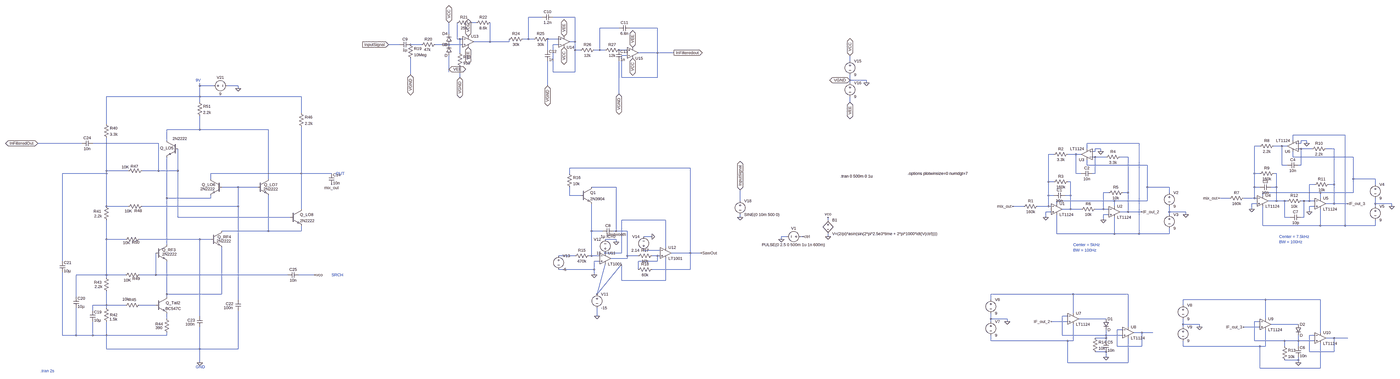
[diagram p0: schematic FullIntegration.asc, whole sheet]
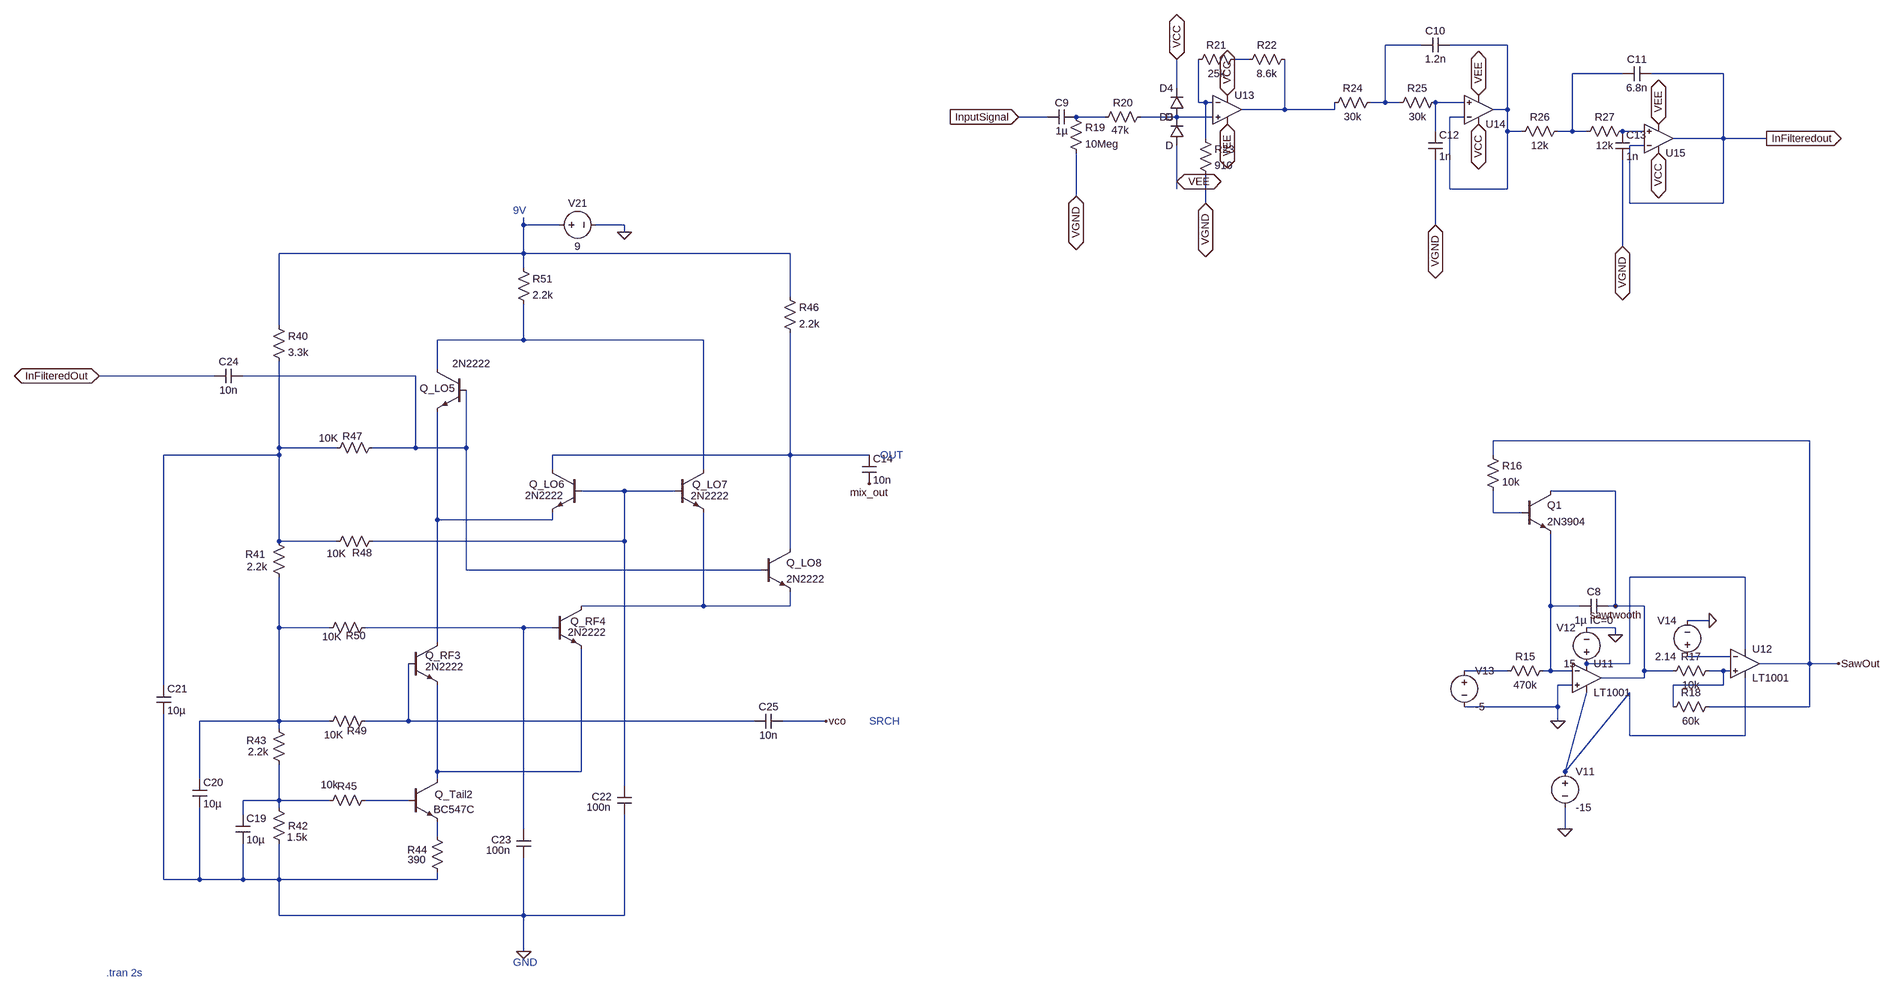
[diagram p1: schematic FullIntegration.asc, part, row 1 of 1, column 1 of 2]
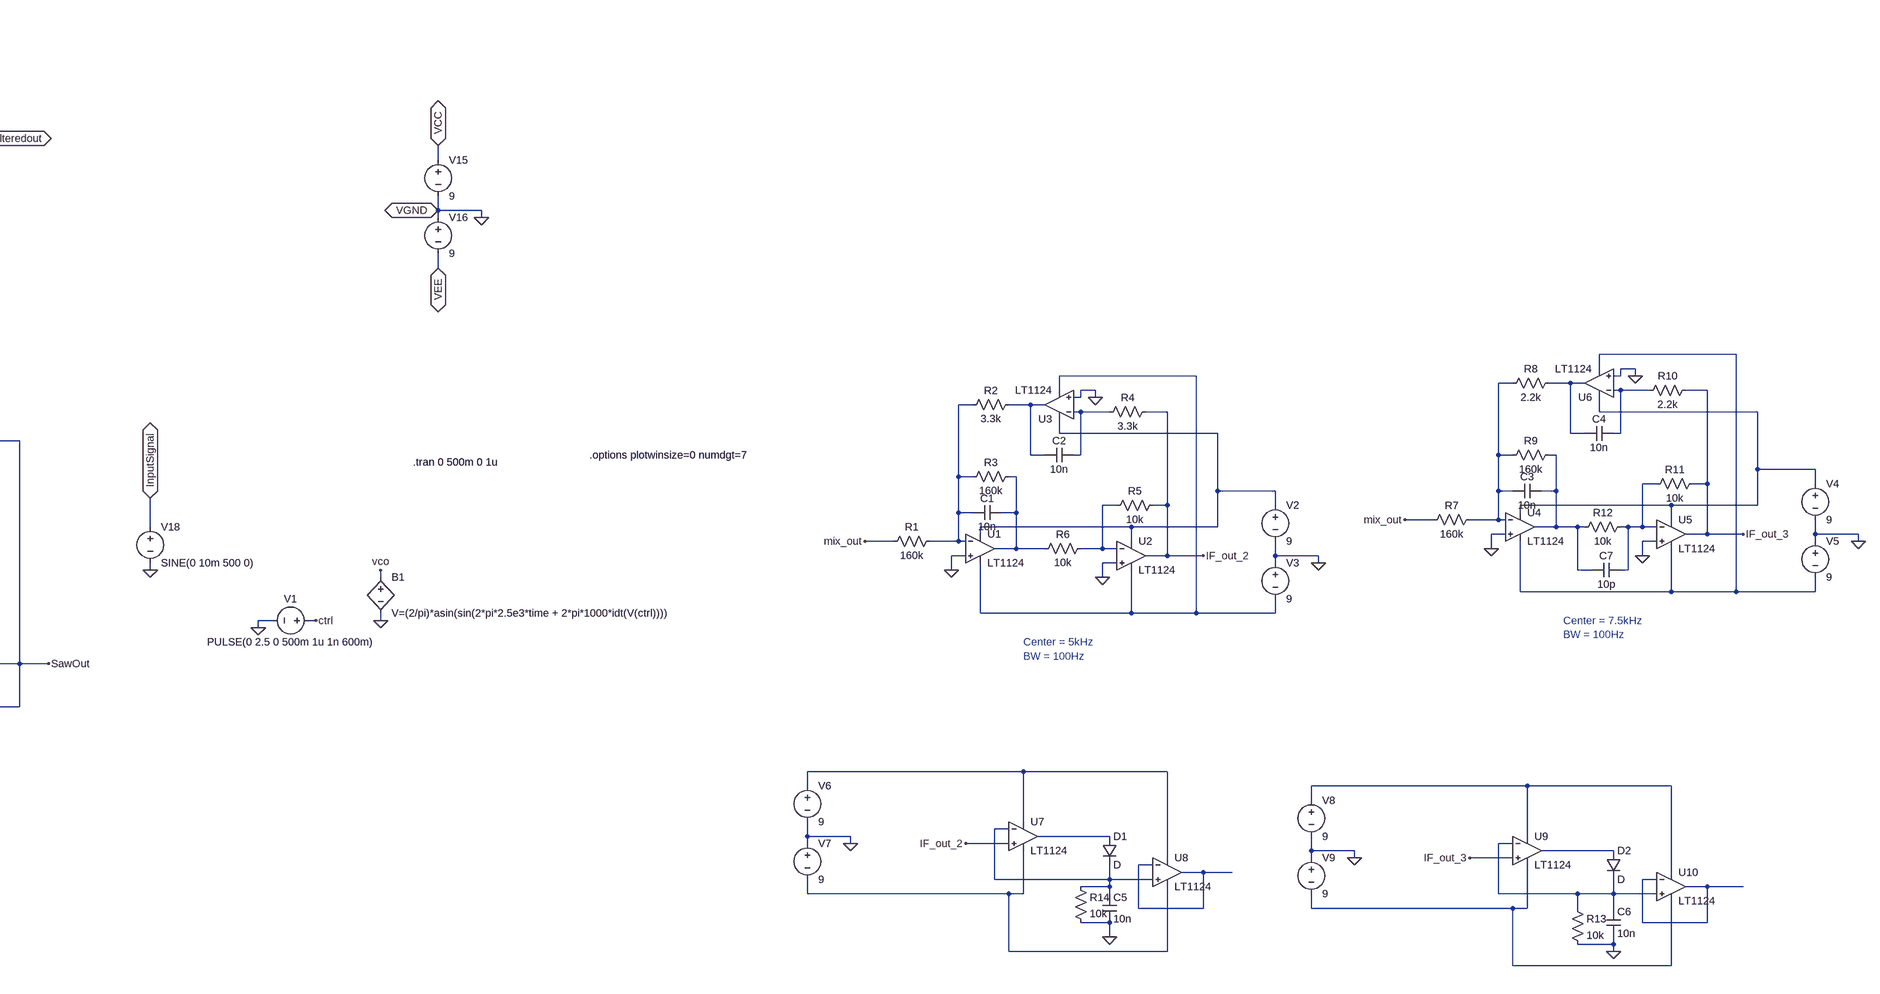
[diagram p2: schematic FullIntegration.asc, part, row 1 of 1, column 2 of 2]
FullIntegration.asc, the LTspice schematic file:
Version 4.1
SHEET 1 3748 744
WIRE -1664 -2064 -1744 -2064
WIRE -1472 -2064 -1600 -2064
WIRE -2400 -2032 -2432 -2032
WIRE -1216 -2000 -1328 -2000
WIRE -992 -2000 -1152 -2000
WIRE -2560 -1968 -2560 -2032
WIRE -2512 -1936 -2512 -2032
WIRE -2496 -1936 -2512 -1936
WIRE -2480 -1936 -2496 -1936
WIRE -1744 -1936 -1744 -2064
WIRE -1744 -1936 -1776 -1936
WIRE -1712 -1936 -1744 -1936
WIRE -1568 -1936 -1632 -1936
WIRE -2320 -1920 -2320 -2032
WIRE -2320 -1920 -2416 -1920
WIRE -1856 -1920 -1856 -1936
WIRE -1856 -1920 -2320 -1920
WIRE -1472 -1920 -1472 -2064
WIRE -1472 -1920 -1504 -1920
WIRE -2848 -1904 -2912 -1904
WIRE -2720 -1904 -2784 -1904
WIRE -2560 -1904 -2640 -1904
WIRE -2480 -1904 -2560 -1904
WIRE -1568 -1904 -1600 -1904
WIRE -1632 -1872 -1632 -1936
WIRE -1472 -1872 -1472 -1920
WIRE -1440 -1872 -1472 -1872
WIRE -1328 -1872 -1328 -2000
WIRE -1328 -1872 -1360 -1872
WIRE -1296 -1872 -1328 -1872
WIRE -1168 -1872 -1216 -1872
WIRE -2496 -1856 -2496 -1936
WIRE -992 -1856 -992 -2000
WIRE -992 -1856 -1104 -1856
WIRE -896 -1856 -992 -1856
WIRE -1168 -1840 -1200 -1840
WIRE 240 -1808 240 -1840
WIRE -2560 -1760 -2560 -1840
WIRE -2560 -1744 -2560 -1760
WIRE -1600 -1744 -1600 -1904
WIRE -1472 -1744 -1472 -1872
WIRE -1472 -1744 -1600 -1744
WIRE -2784 -1728 -2784 -1824
WIRE -2496 -1712 -2496 -1776
WIRE -1200 -1712 -1200 -1840
WIRE -992 -1712 -992 -1856
WIRE -992 -1712 -1200 -1712
WIRE 240 -1696 240 -1728
WIRE 336 -1696 240 -1696
WIRE 240 -1680 240 -1696
WIRE 336 -1680 336 -1696
WIRE -4160 -1664 -4160 -1680
WIRE -4080 -1664 -4160 -1664
WIRE -3936 -1664 -4000 -1664
WIRE -1632 -1664 -1632 -1808
WIRE -3936 -1648 -3936 -1664
WIRE -1216 -1616 -1216 -1808
WIRE -4160 -1600 -4160 -1664
WIRE -4160 -1600 -4704 -1600
WIRE -3568 -1600 -4160 -1600
WIRE -4160 -1568 -4160 -1600
WIRE 240 -1568 240 -1600
WIRE -3568 -1504 -3568 -1600
WIRE -4704 -1440 -4704 -1600
WIRE -4160 -1408 -4160 -1488
WIRE -4160 -1408 -4352 -1408
WIRE -3760 -1408 -4160 -1408
WIRE 3456 -1376 3152 -1376
WIRE -4352 -1344 -4352 -1408
WIRE 3152 -1344 3152 -1376
WIRE 3232 -1344 3200 -1344
WIRE -4848 -1328 -5104 -1328
WIRE -4400 -1328 -4784 -1328
WIRE 2256 -1328 1952 -1328
WIRE 3200 -1328 3200 -1344
WIRE 3200 -1328 3184 -1328
WIRE 3232 -1328 3232 -1344
WIRE 2960 -1312 2928 -1312
WIRE 3088 -1312 3040 -1312
WIRE 3120 -1312 3088 -1312
WIRE 1952 -1296 1952 -1328
WIRE 2032 -1296 2000 -1296
WIRE 3200 -1296 3184 -1296
WIRE 3264 -1296 3200 -1296
WIRE 3392 -1296 3344 -1296
WIRE 2000 -1280 2000 -1296
WIRE 2000 -1280 1984 -1280
WIRE 2032 -1280 2032 -1296
WIRE 1760 -1264 1728 -1264
WIRE 1888 -1264 1840 -1264
WIRE 1920 -1264 1888 -1264
WIRE 2000 -1248 1984 -1248
WIRE 2064 -1248 2000 -1248
WIRE 2192 -1248 2144 -1248
WIRE 3152 -1248 3152 -1280
WIRE 3504 -1248 3152 -1248
WIRE 1952 -1200 1952 -1232
WIRE 2304 -1200 1952 -1200
WIRE 3088 -1200 3088 -1312
WIRE 3120 -1200 3088 -1200
WIRE 3200 -1200 3200 -1296
WIRE 3200 -1200 3184 -1200
WIRE -800 -1184 -1504 -1184
WIRE -4704 -1168 -4704 -1360
WIRE -4576 -1168 -4704 -1168
WIRE -4400 -1168 -4400 -1328
WIRE -4400 -1168 -4496 -1168
WIRE -4288 -1168 -4288 -1296
WIRE -4288 -1168 -4400 -1168
WIRE -4704 -1152 -4704 -1168
WIRE -4704 -1152 -4960 -1152
WIRE -3568 -1152 -3568 -1424
WIRE -3568 -1152 -4096 -1152
WIRE -3392 -1152 -3568 -1152
WIRE -1504 -1152 -1504 -1184
WIRE 1888 -1152 1888 -1264
WIRE 1920 -1152 1888 -1152
WIRE 2000 -1152 2000 -1248
WIRE 2000 -1152 1984 -1152
WIRE 2928 -1152 2928 -1312
WIRE 2960 -1152 2928 -1152
WIRE 3056 -1152 3040 -1152
WIRE -4096 -1120 -4096 -1152
WIRE -3760 -1120 -3760 -1408
WIRE 3504 -1120 3504 -1248
WIRE 3632 -1120 3504 -1120
WIRE 1728 -1104 1728 -1264
WIRE 1760 -1104 1728 -1104
WIRE 1856 -1104 1840 -1104
WIRE 3280 -1088 3248 -1088
WIRE 3392 -1088 3392 -1296
WIRE 3392 -1088 3360 -1088
WIRE 3632 -1088 3632 -1120
WIRE -3936 -1072 -4032 -1072
WIRE -3824 -1072 -3936 -1072
WIRE -1232 -1072 -1376 -1072
WIRE 2304 -1072 2304 -1200
WIRE 2432 -1072 2304 -1072
WIRE 2928 -1072 2928 -1152
WIRE 2960 -1072 2928 -1072
WIRE 3056 -1072 3056 -1152
WIRE 3056 -1072 3024 -1072
WIRE 2080 -1040 2048 -1040
WIRE 2192 -1040 2192 -1248
WIRE 2192 -1040 2160 -1040
WIRE 2432 -1040 2432 -1072
WIRE 3312 -1040 2976 -1040
WIRE 3504 -1040 3504 -1120
WIRE 3504 -1040 3312 -1040
WIRE -1504 -1024 -1504 -1072
WIRE -1440 -1024 -1504 -1024
WIRE 1728 -1024 1728 -1104
WIRE 1760 -1024 1728 -1024
WIRE 1856 -1024 1856 -1104
WIRE 1856 -1024 1824 -1024
WIRE 2976 -1024 2976 -1040
WIRE -4352 -1008 -4352 -1248
WIRE -4096 -1008 -4096 -1024
WIRE -4096 -1008 -4352 -1008
WIRE 2784 -1008 2720 -1008
WIRE 2928 -1008 2928 -1072
WIRE 2928 -1008 2864 -1008
WIRE 2944 -1008 2928 -1008
WIRE 3312 -1008 3312 -1040
WIRE -400 -992 -400 -1056
WIRE 2112 -992 1776 -992
WIRE 2304 -992 2304 -1072
WIRE 2304 -992 2112 -992
WIRE 3056 -992 3056 -1072
WIRE 3056 -992 3008 -992
WIRE 3104 -992 3056 -992
WIRE 3120 -992 3104 -992
WIRE 3216 -992 3200 -992
WIRE 3248 -992 3248 -1088
WIRE 3248 -992 3216 -992
WIRE 3280 -992 3248 -992
WIRE 1776 -976 1776 -992
WIRE 2944 -976 2912 -976
WIRE 3392 -976 3392 -1088
WIRE 3392 -976 3344 -976
WIRE 3472 -976 3392 -976
WIRE 3632 -976 3632 -1008
WIRE 3728 -976 3632 -976
WIRE -4704 -960 -4704 -1152
WIRE -4576 -960 -4704 -960
WIRE -3936 -960 -3936 -1072
WIRE -3936 -960 -4496 -960
WIRE 1584 -960 1520 -960
WIRE 1728 -960 1728 -1024
WIRE 1728 -960 1664 -960
WIRE 1744 -960 1728 -960
WIRE 2112 -960 2112 -992
WIRE 3280 -960 3248 -960
WIRE 3632 -960 3632 -976
WIRE 3728 -960 3728 -976
WIRE -3568 -944 -3568 -1152
WIRE 1856 -944 1856 -1024
WIRE 1856 -944 1808 -944
WIRE 1920 -944 1856 -944
WIRE 2048 -944 2048 -1040
WIRE 2048 -944 2000 -944
WIRE 2080 -944 2048 -944
WIRE 2912 -944 2912 -976
WIRE 1744 -928 1712 -928
WIRE 2192 -928 2192 -1040
WIRE 2192 -928 2144 -928
WIRE 2272 -928 2192 -928
WIRE 2432 -928 2432 -960
WIRE 2528 -928 2432 -928
WIRE 3248 -928 3248 -960
WIRE 2080 -912 2048 -912
WIRE 2432 -912 2432 -928
WIRE 2528 -912 2528 -928
WIRE -4288 -896 -4288 -1168
WIRE -3632 -896 -4288 -896
WIRE -400 -896 -400 -912
WIRE 1712 -896 1712 -928
WIRE 3104 -896 3104 -992
WIRE 3136 -896 3104 -896
WIRE 3216 -896 3216 -992
WIRE 3216 -896 3200 -896
WIRE -944 -880 -1200 -880
WIRE 112 -880 112 -896
WIRE 2048 -880 2048 -912
WIRE 2976 -848 2976 -960
WIRE 3312 -848 3312 -944
WIRE 3312 -848 2976 -848
WIRE 3456 -848 3456 -1376
WIRE 3456 -848 3312 -848
WIRE 3632 -848 3632 -880
WIRE 3632 -848 3456 -848
WIRE -3760 -816 -3760 -1024
WIRE -3760 -816 -4032 -816
WIRE -3568 -816 -3568 -848
WIRE -3568 -816 -3760 -816
WIRE -1376 -816 -1376 -976
WIRE -1312 -816 -1376 -816
WIRE -1232 -816 -1232 -1072
WIRE -1232 -816 -1248 -816
WIRE -1168 -816 -1232 -816
WIRE 1776 -800 1776 -912
WIRE 2112 -800 2112 -896
WIRE 2112 -800 1776 -800
WIRE 2256 -800 2256 -1328
WIRE 2256 -800 2112 -800
WIRE 2432 -800 2432 -832
WIRE 2432 -800 2256 -800
WIRE -1024 -784 -1072 -784
WIRE -128 -784 -160 -784
WIRE -32 -784 -48 -784
WIRE 112 -784 112 -800
WIRE -4704 -768 -4704 -880
WIRE -4592 -768 -4704 -768
WIRE -4160 -768 -4512 -768
WIRE -4096 -768 -4160 -768
WIRE -1232 -768 -1296 -768
WIRE -160 -768 -160 -784
WIRE -1232 -752 -1232 -768
WIRE -4352 -736 -4352 -1008
WIRE -944 -720 -944 -880
WIRE -976 -704 -1072 -704
WIRE -1200 -688 -1200 -880
WIRE -1200 -688 -1296 -688
WIRE -800 -688 -800 -1184
WIRE -800 -688 -912 -688
WIRE -736 -688 -800 -688
WIRE -1472 -672 -1568 -672
WIRE -1376 -672 -1376 -816
WIRE -1376 -672 -1392 -672
WIRE -1328 -672 -1376 -672
WIRE -1168 -672 -1168 -816
WIRE -1104 -672 -1168 -672
WIRE -992 -672 -1024 -672
WIRE -976 -672 -992 -672
WIRE -1168 -656 -1168 -672
WIRE -1168 -656 -1264 -656
WIRE -4960 -640 -4960 -1152
WIRE -1328 -640 -1360 -640
WIRE -992 -640 -992 -672
WIRE -992 -640 -1104 -640
WIRE -1360 -592 -1360 -640
WIRE -1360 -592 -1568 -592
WIRE -1104 -592 -1104 -640
WIRE -800 -592 -800 -688
WIRE -800 -592 -1024 -592
WIRE -4704 -560 -4704 -768
WIRE -4704 -560 -4880 -560
WIRE -4592 -560 -4704 -560
WIRE -4416 -560 -4416 -688
WIRE -4416 -560 -4512 -560
WIRE -3648 -560 -4416 -560
WIRE -3488 -560 -3584 -560
WIRE -1360 -560 -1360 -592
WIRE -4704 -544 -4704 -560
WIRE -1200 -528 -1200 -624
WIRE -944 -528 -944 -656
WIRE -944 -528 -1200 -528
WIRE -4352 -448 -4352 -640
WIRE -4032 -448 -4032 -720
WIRE -4032 -448 -4352 -448
WIRE -1344 -448 -1296 -624
WIRE -1344 -448 -1200 -624
WIRE 1872 -448 1392 -448
WIRE 2192 -448 1872 -448
WIRE -4880 -432 -4880 -560
WIRE -4352 -432 -4352 -448
WIRE -3936 -416 -3936 -960
WIRE 1392 -416 1392 -448
WIRE 2992 -416 2512 -416
WIRE 3312 -416 2992 -416
WIRE -4704 -384 -4704 -464
WIRE -4704 -384 -4784 -384
WIRE -4592 -384 -4704 -384
WIRE -4416 -384 -4512 -384
WIRE 2512 -384 2512 -416
WIRE -4704 -368 -4704 -384
WIRE -4784 -352 -4784 -384
WIRE 1872 -336 1872 -448
WIRE -4160 -320 -4160 -768
WIRE -1344 -320 -1344 -368
WIRE 1840 -320 1808 -320
WIRE -4352 -304 -4352 -336
WIRE 1392 -304 1392 -336
WIRE 1488 -304 1392 -304
WIRE 2064 -304 1904 -304
WIRE 2992 -304 2992 -416
WIRE 1392 -288 1392 -304
WIRE 1488 -288 1488 -304
WIRE 1840 -288 1744 -288
WIRE 2960 -288 2928 -288
WIRE 2512 -272 2512 -304
WIRE 2608 -272 2512 -272
WIRE 3184 -272 3024 -272
WIRE 2192 -256 2192 -448
WIRE 2512 -256 2512 -272
WIRE 2608 -256 2608 -272
WIRE 2960 -256 2864 -256
WIRE 2160 -240 2128 -240
WIRE 2272 -224 2224 -224
WIRE 2336 -224 2272 -224
WIRE 3312 -224 3312 -416
WIRE -4960 -208 -4960 -576
WIRE -4880 -208 -4880 -368
WIRE -4880 -208 -4960 -208
WIRE -4784 -208 -4784 -288
WIRE -4784 -208 -4880 -208
WIRE -4704 -208 -4704 -288
WIRE -4704 -208 -4784 -208
WIRE -4352 -208 -4352 -224
WIRE -4352 -208 -4704 -208
WIRE 1808 -208 1808 -320
WIRE 2064 -208 2064 -240
WIRE 2064 -208 1808 -208
WIRE 2160 -208 2064 -208
WIRE 3280 -208 3248 -208
WIRE 2064 -192 2064 -208
WIRE 2064 -192 2000 -192
WIRE 3392 -192 3344 -192
WIRE 3472 -192 3392 -192
WIRE 1392 -176 1392 -208
WIRE 1840 -176 1392 -176
WIRE 1872 -176 1872 -272
WIRE 1872 -176 1840 -176
WIRE 2064 -176 2064 -192
WIRE 2928 -176 2928 -288
WIRE 3104 -176 2928 -176
WIRE 3184 -176 3184 -208
WIRE 3184 -176 3104 -176
WIRE 3280 -176 3184 -176
WIRE 2128 -144 2128 -240
WIRE 2272 -144 2272 -224
WIRE 2272 -144 2128 -144
WIRE 2512 -144 2512 -176
WIRE 2960 -144 2512 -144
WIRE 2992 -144 2992 -240
WIRE 2992 -144 2960 -144
WIRE 3104 -144 3104 -176
WIRE 3184 -144 3184 -176
WIRE -4704 -128 -4704 -208
WIRE -4160 -128 -4160 -256
WIRE -4160 -128 -4704 -128
WIRE -3936 -128 -3936 -352
WIRE -3936 -128 -4160 -128
WIRE 2064 -112 2000 -112
WIRE 3248 -112 3248 -208
WIRE 3392 -112 3392 -192
WIRE 3392 -112 3248 -112
WIRE 2064 -80 2064 -112
WIRE 3184 -64 3184 -80
WIRE 3184 -64 3104 -64
WIRE -4160 -48 -4160 -128
WIRE 1840 -48 1840 -176
WIRE 2192 -48 2192 -192
WIRE 2192 -48 1840 -48
WIRE 3184 -48 3184 -64
WIRE 2960 -16 2960 -144
WIRE 3312 -16 3312 -160
WIRE 3312 -16 2960 -16
FLAG -32 -784 ctrl
FLAG 112 -896 vco
FLAG -160 -768 0
FLAG 112 -784 0
FLAG 2032 -1280 0
FLAG 2048 -880 0
FLAG 1712 -896 0
FLAG 2528 -912 0
FLAG 1520 -960 mix_out
FLAG 2272 -928 IF_out_2
FLAG 3232 -1328 0
FLAG 3248 -928 0
FLAG 2912 -944 0
FLAG 3728 -960 0
FLAG 2720 -1008 mix_out
FLAG 3472 -976 IF_out_3
FLAG 1488 -288 0
FLAG 2064 -80 0
FLAG 1744 -288 IF_out_2
FLAG 2608 -256 0
FLAG 3184 -48 0
FLAG 2864 -256 IF_out_3
FLAG -1232 -752 0
FLAG -1344 -320 0
FLAG -1360 -560 0
FLAG -1024 -784 0
FLAG -1232 -816 sawtwooth
FLAG -736 -688 SawOut
FLAG -2448 -1952 VCC
IOPIN -2448 -1952 BiDir
FLAG -2448 -1888 VEE
IOPIN -2448 -1888 BiDir
FLAG -2560 -2032 VCC
IOPIN -2560 -2032 BiDir
FLAG -2560 -1760 VEE
IOPIN -2560 -1760 BiDir
FLAG -1536 -1888 VCC
IOPIN -1536 -1888 BiDir
FLAG -1136 -1824 VCC
IOPIN -1136 -1824 BiDir
FLAG -1536 -1952 VEE
IOPIN -1536 -1952 BiDir
FLAG -1136 -1888 VEE
IOPIN -1136 -1888 BiDir
FLAG -2784 -1728 VGND
IOPIN -2784 -1728 BiDir
FLAG -2496 -1712 VGND
IOPIN -2496 -1712 BiDir
FLAG -1632 -1664 VGND
IOPIN -1632 -1664 BiDir
FLAG -1216 -1616 VGND
IOPIN -1216 -1616 BiDir
FLAG -2912 -1904 InputSignal
IOPIN -2912 -1904 In
FLAG -896 -1856 InFilteredout
IOPIN -896 -1856 Out
FLAG 336 -1680 0
FLAG 240 -1840 VCC
IOPIN 240 -1840 BiDir
FLAG 240 -1568 VEE
IOPIN 240 -1568 BiDir
FLAG 240 -1696 VGND
IOPIN 240 -1696 BiDir
FLAG -400 -896 0
FLAG -400 -1056 InputSignal
IOPIN -400 -1056 BiDir
FLAG -5104 -1328 InFilteredOut
IOPIN -5104 -1328 BiDir
FLAG -3936 -1648 0
FLAG -4160 -48 0
FLAG -3392 -1088 mix_out
FLAG -3488 -560 vco
SYMBOL bv 112 -896 R0
SYMATTR InstName B1
SYMATTR Value V=(2/pi)*asin(sin(2*pi*2.5e3*time + 2*pi*1000*idt(V(ctrl))))
SYMBOL voltage -32 -784 R90
WINDOW 0 -32 56 VBottom 2
WINDOW 3 32 56 VTop 2
WINDOW 123 0 0 Left 0
WINDOW 39 0 0 Left 0
SYMATTR InstName V1
SYMATTR Value PULSE(0 2.5 0 500m 1u 1n 600m)
SYMBOL OpAmps\\LT1124 1776 -1008 R0
SYMATTR InstName U1
SYMBOL OpAmps\\LT1124 2112 -992 R0
SYMATTR InstName U2
SYMBOL OpAmps\\LT1124 1952 -1200 R180
SYMATTR InstName U3
SYMBOL res 1680 -976 R90
WINDOW 0 0 56 VBottom 2
WINDOW 3 32 56 VTop 2
SYMATTR InstName R1
SYMATTR Value 160k
SYMATTR SpiceLine tol=1
SYMBOL res 1856 -1280 R90
WINDOW 0 0 56 VBottom 2
WINDOW 3 32 56 VTop 2
SYMATTR InstName R2
SYMATTR Value 3.3k
SYMATTR SpiceLine tol=1
SYMBOL res 1856 -1120 R90
WINDOW 0 0 56 VBottom 2
WINDOW 3 32 56 VTop 2
SYMATTR InstName R3
SYMATTR Value 160k
SYMATTR SpiceLine tol=1
SYMBOL res 2160 -1264 R90
WINDOW 0 0 56 VBottom 2
WINDOW 3 32 56 VTop 2
SYMATTR InstName R4
SYMATTR Value 3.3k
SYMATTR SpiceLine tol=1
SYMBOL res 2176 -1056 R90
WINDOW 0 0 56 VBottom 2
WINDOW 3 32 56 VTop 2
SYMATTR InstName R5
SYMATTR Value 10k
SYMATTR SpiceLine tol=1
SYMBOL res 2016 -960 R90
WINDOW 0 0 56 VBottom 2
WINDOW 3 32 56 VTop 2
SYMATTR InstName R6
SYMATTR Value 10k
SYMATTR SpiceLine tol=1
SYMBOL cap 1824 -1040 R90
WINDOW 0 0 32 VBottom 2
WINDOW 3 32 32 VTop 2
SYMATTR InstName C1
SYMATTR Value 10n
SYMBOL cap 1984 -1168 R90
WINDOW 0 0 32 VBottom 2
WINDOW 3 32 32 VTop 2
SYMATTR InstName C2
SYMATTR Value 10n
SYMBOL voltage 2432 -1056 R0
WINDOW 123 0 0 Left 0
WINDOW 39 0 0 Left 0
SYMATTR InstName V2
SYMATTR Value 9
SYMBOL voltage 2432 -928 R0
WINDOW 123 0 0 Left 0
WINDOW 39 0 0 Left 0
SYMATTR InstName V3
SYMATTR Value 9
SYMBOL OpAmps\\LT1124 2976 -1056 R0
SYMATTR InstName U4
SYMBOL OpAmps\\LT1124 3312 -1040 R0
SYMATTR InstName U5
SYMBOL OpAmps\\LT1124 3152 -1248 R180
SYMATTR InstName U6
SYMBOL res 2880 -1024 R90
WINDOW 0 0 56 VBottom 2
WINDOW 3 32 56 VTop 2
SYMATTR InstName R7
SYMATTR Value 160k
SYMATTR SpiceLine tol=1
SYMBOL res 3056 -1328 R90
WINDOW 0 0 56 VBottom 2
WINDOW 3 32 56 VTop 2
SYMATTR InstName R8
SYMATTR Value 2.2k
SYMATTR SpiceLine tol=1
SYMBOL res 3056 -1168 R90
WINDOW 0 0 56 VBottom 2
WINDOW 3 32 56 VTop 2
SYMATTR InstName R9
SYMATTR Value 160k
SYMATTR SpiceLine tol=1
SYMBOL res 3360 -1312 R90
WINDOW 0 0 56 VBottom 2
WINDOW 3 32 56 VTop 2
SYMATTR InstName R10
SYMATTR Value 2.2k
SYMATTR SpiceLine tol=0.1
SYMBOL res 3376 -1104 R90
WINDOW 0 0 56 VBottom 2
WINDOW 3 32 56 VTop 2
SYMATTR InstName R11
SYMATTR Value 10k
SYMATTR SpiceLine tol=1
SYMBOL res 3216 -1008 R90
WINDOW 0 0 56 VBottom 2
WINDOW 3 32 56 VTop 2
SYMATTR InstName R12
SYMATTR Value 10k
SYMATTR SpiceLine tol=1
SYMBOL cap 3024 -1088 R90
WINDOW 0 0 32 VBottom 2
WINDOW 3 32 32 VTop 2
SYMATTR InstName C3
SYMATTR Value 10n
SYMBOL cap 3184 -1216 R90
WINDOW 0 0 32 VBottom 2
WINDOW 3 32 32 VTop 2
SYMATTR InstName C4
SYMATTR Value 10n
SYMBOL voltage 3632 -1104 R0
WINDOW 123 0 0 Left 0
WINDOW 39 0 0 Left 0
SYMATTR InstName V4
SYMATTR Value 9
SYMBOL voltage 3632 -976 R0
WINDOW 123 0 0 Left 0
WINDOW 39 0 0 Left 0
SYMATTR InstName V5
SYMATTR Value 9
SYMBOL OpAmps\\LT1124 1872 -368 R0
SYMATTR InstName U7
SYMBOL voltage 1392 -432 R0
WINDOW 123 0 0 Left 0
WINDOW 39 0 0 Left 0
SYMATTR InstName V6
SYMATTR Value 9
SYMBOL voltage 1392 -304 R0
WINDOW 123 0 0 Left 0
WINDOW 39 0 0 Left 0
SYMATTR InstName V7
SYMATTR Value 9
SYMBOL diode 2048 -304 R0
SYMATTR InstName D1
SYMBOL cap 2048 -176 R0
SYMATTR InstName C5
SYMATTR Value 10n
SYMBOL OpAmps\\LT1124 2192 -288 R0
SYMATTR InstName U8
SYMBOL OpAmps\\LT1124 2992 -336 R0
SYMATTR InstName U9
SYMBOL voltage 2512 -400 R0
WINDOW 123 0 0 Left 0
WINDOW 39 0 0 Left 0
SYMATTR InstName V8
SYMATTR Value 9
SYMBOL voltage 2512 -272 R0
WINDOW 123 0 0 Left 0
WINDOW 39 0 0 Left 0
SYMATTR InstName V9
SYMATTR Value 9
SYMBOL diode 3168 -272 R0
SYMATTR InstName D2
SYMBOL cap 3168 -144 R0
SYMATTR InstName C6
SYMATTR Value 10n
SYMBOL OpAmps\\LT1124 3312 -256 R0
SYMATTR InstName U10
SYMBOL res 3088 -160 R0
SYMATTR InstName R13
SYMATTR Value 10k
SYMBOL res 1984 -208 R0
SYMATTR InstName R14
SYMATTR Value 10k
SYMBOL cap 3200 -912 R90
WINDOW 0 0 32 VBottom 2
WINDOW 3 32 32 VTop 2
SYMATTR InstName C7
SYMATTR Value 10p
SYMBOL OpAmps\\LT1001 -1296 -720 R0
SYMATTR InstName U11
SYMBOL voltage -1344 -464 R0
WINDOW 123 0 0 Left 0
WINDOW 39 0 0 Left 0
SYMATTR InstName V11
SYMATTR Value -15
SYMBOL voltage -1296 -672 R180
WINDOW 0 24 96 Left 2
WINDOW 3 24 16 Left 2
WINDOW 123 0 0 Left 0
WINDOW 39 0 0 Left 0
SYMATTR InstName V12
SYMATTR Value 15
SYMBOL cap -1248 -832 R90
WINDOW 0 0 32 VBottom 2
WINDOW 3 32 32 VTop 2
SYMATTR InstName C8
SYMATTR Value 1µ IC=0
SYMBOL res -1376 -688 R90
WINDOW 0 0 56 VBottom 2
WINDOW 3 32 56 VTop 2
SYMATTR InstName R15
SYMATTR Value 470k
SYMATTR SpiceLine tol=5
SYMBOL voltage -1568 -688 R0
WINDOW 123 0 0 Left 0
WINDOW 39 0 0 Left 0
SYMATTR InstName V13
SYMATTR Value -5
SYMBOL voltage -1072 -688 R180
WINDOW 0 24 96 Left 2
WINDOW 3 24 16 Left 2
WINDOW 123 0 0 Left 0
WINDOW 39 0 0 Left 0
SYMATTR InstName V14
SYMATTR Value 2.14
SYMBOL npn -1440 -1072 R0
SYMATTR InstName Q1
SYMATTR Value 2N3904
SYMBOL res -1520 -1168 R0
SYMATTR InstName R16
SYMATTR Value 10k
SYMBOL OpAmps\\LT1001 -944 -752 R0
SYMATTR InstName U12
SYMBOL res -1008 -688 R90
WINDOW 0 0 56 VBottom 2
WINDOW 3 32 56 VTop 2
SYMATTR InstName R17
SYMATTR Value 10k
SYMBOL res -1008 -608 R90
WINDOW 0 0 56 VBottom 2
WINDOW 3 32 56 VTop 2
SYMATTR InstName R18
SYMATTR Value 60k
SYMBOL OpAmps\\UniversalOpAmp2 -2448 -1920 R0
SYMATTR InstName U13
SYMBOL cap -2784 -1920 R90
WINDOW 0 0 32 VBottom 2
WINDOW 3 32 32 VTop 2
SYMATTR InstName C9
SYMATTR Value 1µ
SYMBOL res -2800 -1920 R0
SYMATTR InstName R19
SYMATTR Value 10Meg
SYMBOL res -2624 -1920 R90
WINDOW 0 0 56 VBottom 2
WINDOW 3 30 62 VTop 2
SYMATTR InstName R20
SYMATTR Value 47k
SYMBOL diode -2544 -1840 R180
WINDOW 0 24 64 Left 2
WINDOW 3 24 0 Left 2
SYMATTR InstName D3
SYMBOL diode -2544 -1904 R180
WINDOW 0 24 64 Left 2
WINDOW 3 24 0 Left 2
SYMATTR InstName D4
SYMBOL res -2416 -2048 R90
WINDOW 0 0 56 VBottom 2
WINDOW 3 32 56 VTop 2
SYMATTR InstName R21
SYMATTR Value 25k
SYMBOL res -2304 -2048 R90
WINDOW 0 0 56 VBottom 2
WINDOW 3 32 56 VTop 2
SYMATTR InstName R22
SYMATTR Value 8.6k
SYMBOL res -2512 -1872 R0
SYMATTR InstName R23
SYMATTR Value 910
SYMBOL res -1760 -1952 R90
WINDOW 0 0 56 VBottom 2
WINDOW 3 32 56 VTop 2
SYMATTR InstName R24
SYMATTR Value 30k
SYMBOL res -1616 -1952 R90
WINDOW 0 0 56 VBottom 2
WINDOW 3 32 56 VTop 2
SYMATTR InstName R25
SYMATTR Value 30k
SYMBOL res -1344 -1888 R90
WINDOW 0 0 56 VBottom 2
WINDOW 3 32 56 VTop 2
SYMATTR InstName R26
SYMATTR Value 12k
SYMBOL res -1200 -1888 R90
WINDOW 0 0 56 VBottom 2
WINDOW 3 32 56 VTop 2
SYMATTR InstName R27
SYMATTR Value 12k
SYMBOL cap -1600 -2080 R90
WINDOW 0 0 32 VBottom 2
WINDOW 3 32 32 VTop 2
SYMATTR InstName C10
SYMATTR Value 1.2n
SYMBOL cap -1152 -2016 R90
WINDOW 0 0 32 VBottom 2
WINDOW 3 32 32 VTop 2
SYMATTR InstName C11
SYMATTR Value 6.8n
SYMBOL OpAmps\\UniversalOpAmp2 -1536 -1920 M180
SYMATTR InstName U14
SYMATTR Value2 Avol=1Meg GBW=3Meg Slew=10Meg
SYMBOL OpAmps\\UniversalOpAmp2 -1136 -1856 M180
SYMATTR InstName U15
SYMATTR Value2 Avol=1Meg GBW=3Meg Slew=10Meg
SYMBOL cap -1648 -1872 R0
SYMATTR InstName C12
SYMATTR Value 1n
SYMBOL cap -1232 -1872 R0
SYMATTR InstName C13
SYMATTR Value 1n
SYMBOL voltage 240 -1824 R0
WINDOW 123 0 0 Left 0
WINDOW 39 0 0 Left 0
SYMATTR InstName V15
SYMATTR Value 9
SYMBOL voltage 240 -1696 R0
WINDOW 123 0 0 Left 0
WINDOW 39 0 0 Left 0
SYMATTR InstName V16
SYMATTR Value 9
SYMBOL voltage -400 -1008 R0
WINDOW 123 0 0 Left 0
WINDOW 39 0 0 Left 0
SYMATTR InstName V18
SYMATTR Value SINE(0 10m 500 0)
SYMBOL npn -4416 -736 R0
WINDOW 0 37 30 Left 2
WINDOW 3 37 55 Left 2
SYMATTR InstName Q_RF3
SYMATTR Value 2N2222
SYMBOL npn -4416 -432 R0
WINDOW 0 58 35 Left 2
SYMATTR InstName Q_Tail2
SYMATTR Value BC547C
SYMBOL res -4720 -1456 R0
SYMATTR InstName R40
SYMATTR Value 3.3k
SYMBOL res -4720 -976 R0
WINDOW 0 -59 45 Left 2
WINDOW 3 -55 72 Left 2
SYMATTR InstName R41
SYMATTR Value 2.2k
SYMBOL res -4720 -384 R0
WINDOW 0 36 57 Left 2
WINDOW 3 34 82 Left 2
SYMATTR InstName R42
SYMATTR Value 1.5k
SYMBOL res -4720 -560 R0
WINDOW 0 -56 43 Left 2
WINDOW 3 -53 68 Left 2
SYMATTR InstName R43
SYMATTR Value 2.2k
SYMBOL cap -4800 -352 R0
SYMATTR Value 10µ
SYMATTR InstName C19
SYMATTR SpiceLine V=10 Irms=23m Rser=2.4699 Lser=942p mfg="Würth Elektronik" pn="865090240001 WCAP-ASLU 4x5,5" type="Al electrolytic"
SYMBOL cap -4896 -432 R0
SYMATTR Value 10µ
SYMATTR InstName C20
SYMATTR SpiceLine V=10 Irms=23m Rser=2.4699 Lser=942p mfg="Würth Elektronik" pn="865090240001 WCAP-ASLU 4x5,5" type="Al electrolytic"
SYMBOL cap -4976 -640 R0
SYMATTR Value 10µ
SYMATTR InstName C21
SYMATTR SpiceLine V=10 Irms=23m Rser=2.4699 Lser=942p mfg="Würth Elektronik" pn="865090240001 WCAP-ASLU 4x5,5" type="Al electrolytic"
SYMBOL res -4368 -320 R0
WINDOW 0 -51 46 Left 2
WINDOW 3 -50 68 Left 2
SYMATTR InstName R44
SYMATTR Value 390
SYMBOL res -4496 -400 R90
WINDOW 0 0 56 VBottom 2
WINDOW 3 -34 96 VTop 2
SYMATTR InstName R45
SYMATTR Value 10k
SYMBOL npn -4096 -816 R0
WINDOW 0 40 34 Left 2
WINDOW 3 34 58 Left 2
SYMATTR InstName Q_RF4
SYMATTR Value 2N2222
SYMBOL npn -4288 -1344 M0
WINDOW 0 25 44 Left 2
WINDOW 3 -54 -11 Left 2
SYMATTR InstName Q_LO5
SYMATTR Value 2N2222
SYMBOL npn -4032 -1120 M0
WINDOW 0 38 33 Left 2
WINDOW 3 40 58 Left 2
SYMATTR InstName Q_LO6
SYMATTR Value 2N2222
SYMBOL npn -3824 -1120 R0
WINDOW 0 39 34 Left 2
WINDOW 3 35 59 Left 2
SYMATTR InstName Q_LO7
SYMATTR Value 2N2222
SYMBOL npn -3632 -944 R0
SYMATTR InstName Q_LO8
SYMATTR Value 2N2222
SYMBOL res -3584 -1520 R0
SYMATTR InstName R46
SYMATTR Value 2.2k
SYMBOL res -4480 -1184 R90
WINDOW 0 6 61 VBottom 2
WINDOW 3 -21 114 VTop 2
SYMATTR InstName R47
SYMATTR Value 10K
SYMATTR SpiceLine tol=1 pwr=0.1
SYMBOL res -4480 -976 R90
WINDOW 0 57 39 VBottom 2
WINDOW 3 28 96 VTop 2
SYMATTR InstName R48
SYMATTR Value 10K
SYMATTR SpiceLine tol=1 pwr=0.1
SYMBOL cap -3920 -352 R180
WINDOW 0 44 40 Left 2
WINDOW 3 46 17 Left 2
SYMATTR InstName C22
SYMATTR Value 100n
SYMATTR SpiceLine V=10 Irms=0 Rser=0.025 Lser=913p
SYMBOL res -4496 -576 R90
WINDOW 0 53 35 VBottom 2
WINDOW 3 31 86 VTop 2
SYMATTR InstName R49
SYMATTR Value 10K
SYMATTR SpiceLine tol=1 pwr=0.1
SYMBOL res -4496 -784 R90
WINDOW 0 49 37 VBottom 2
WINDOW 3 21 90 VTop 2
SYMATTR InstName R50
SYMATTR Value 10K
SYMATTR SpiceLine tol=1 pwr=0.1
SYMBOL cap -4144 -256 R180
WINDOW 0 44 40 Left 2
WINDOW 3 46 17 Left 2
SYMATTR InstName C23
SYMATTR Value 100n
SYMATTR SpiceLine V=10 Irms=0 Rser=0.025 Lser=913p
SYMBOL res -4176 -1584 R0
SYMATTR InstName R51
SYMATTR Value 2.2k
SYMBOL cap -4784 -1344 R90
WINDOW 0 0 32 VBottom 2
WINDOW 3 32 32 VTop 2
SYMATTR InstName C24
SYMATTR Value 10n
SYMBOL cap -3584 -576 R90
WINDOW 0 0 32 VBottom 2
WINDOW 3 32 32 VTop 2
SYMATTR InstName C25
SYMATTR Value 10n
SYMBOL voltage -4096 -1664 R270
WINDOW 0 32 56 VTop 2
WINDOW 3 -32 56 VBottom 2
WINDOW 123 0 0 Left 0
WINDOW 39 0 0 Left 0
SYMATTR InstName V21
SYMATTR Value 9
SYMBOL cap -3408 -1152 R0
SYMATTR InstName C14
SYMATTR Value 10n
TEXT 184 -1136 Left 2 !.tran 0 500m 0 1u
TEXT 576 -1152 Left 2 !.options plotwinsize=0 numdgt=7
TEXT 1872 -736 Left 2 ;Center = 5kHz\nBW = 100Hz
TEXT 3072 -784 Left 2 ;Center = 7.5kHz\nBW = 100Hz
TEXT -4184 -24 Left 2 ;GND
TEXT -4184 -1696 Left 2 ;9V
TEXT -3392 -560 Left 2 ;SRCH
TEXT -3368 -1152 Left 2 ;OUT
TEXT -5088 0 Left 2 ;.tran 2s

The netlist it stands for:
* FullIntegration.asc
B1 vco 0 V=(2/pi)*asin(sin(2*pi*2.5e3*time + 2*pi*1000*idt(V(ctrl))))
V1 ctrl 0 PULSE(0 2.5 0 500m 1u 1n 600m)
X§U1 0 N019 N023 N015 N027 LT1124  ; pins In+ In- V+ V- OUT
X§U2 0 N030 N023 N015 IF_out_2 LT1124  ; pins In+ In- V+ V- OUT
X§U3 0 N021 N023 N015 N020 LT1124  ; pins In+ In- V+ V- OUT
R1 N019 mix_out 160k tol=1
R2 N020 N019 3.3k tol=1
R3 N027 N019 160k tol=1
R4 IF_out_2 N021 3.3k tol=1
R5 IF_out_2 N030 10k tol=1
R6 N030 N027 10k tol=1
C1 N027 N019 10n
C2 N021 N020 10n
V2 N023 0 9
V3 0 N015 9
X§U4 0 N016 N022 N013 N026 LT1124  ; pins In+ In- V+ V- OUT
X§U5 0 N028 N022 N013 IF_out_3 LT1124  ; pins In+ In- V+ V- OUT
X§U6 0 N018 N022 N013 N017 LT1124  ; pins In+ In- V+ V- OUT
R7 N016 mix_out 160k tol=1
R8 N017 N016 2.2k tol=1
R9 N026 N016 160k tol=1
R10 IF_out_3 N018 2.2k tol=0.1
R11 IF_out_3 N028 10k tol=1
R12 N028 N026 10k tol=1
C3 N026 N016 10n
C4 N018 N017 10n
V4 N022 0 9
V5 0 N013 9
X§U7 IF_out_2 N048 N044 N055 N050 LT1124  ; pins In+ In- V+ V- OUT
V6 N044 0 9
V7 0 N055 9
D1 N050 N048 D
C5 N048 0 10n
X§U8 N048 N053 N044 N055 N053 LT1124  ; pins In+ In- V+ V- OUT
X§U9 IF_out_3 N051 N045 N056 N052 LT1124  ; pins In+ In- V+ V- OUT
V8 N045 0 9
V9 0 N056 9
D2 N052 N051 D
C6 N051 0 10n
X§U10 N051 N054 N045 N056 N054 LT1124  ; pins In+ In- V+ V- OUT
R13 N051 0 10k
R14 N048 0 10k
C7 N028 N026 10p
X§U11 0 N035 N033 N042 sawtwooth LT1001  ; pins In+ In- V+ V- OUT
V11 N042 0 -15
V12 N033 0 15
C8 sawtwooth N035 1µ IC=0
R15 N035 N039 470k tol=5
V13 N039 0 -5
V14 N038 0 2.14
Q1 sawtwooth N031 N035 0 2N3904
R16 SawOut N031 10k
X§U12 N040 N038 N033 N042 SawOut LT1001  ; pins In+ In- V+ V- OUT
R17 N040 sawtwooth 10k
R18 SawOut N040 60k
X§U13 N009 N005 VCC VEE N007 level2 Avol=1Meg GBW=10Meg Slew=10Meg Ilimit=25m Rail=0 Vos=0 En=0 Enk=0 In=0 Ink=0 Rin=500Meg  ; pins In+ In- V+ V- OUT
C9 N008 InputSignal 1µ
R19 N008 0 10Meg
R20 N009 N008 47k
D3 VEE N009 D
D4 N009 VCC D
R21 N003 N005 25k
R22 N007 N003 8.6k
R23 N005 0 910
R24 N001 N007 30k
R25 N006 N001 30k
R26 N004 N002 12k
R27 N010 N004 12k
C10 N002 N001 1.2n
C11 InFilteredout N004 6.8n
X§U14 N006 N002 VCC VEE N002 level2 Avol=1Meg GBW=3Meg Slew=10Meg Ilimit=25m Rail=0 Vos=0 En=0 Enk=0 In=0 Ink=0 Rin=500Meg  ; pins In+ In- V+ V- OUT
X§U15 N010 InFilteredout VCC VEE InFilteredout level2 Avol=1Meg GBW=3Meg Slew=10Meg Ilimit=25m Rail=0 Vos=0 En=0 Enk=0 In=0 Ink=0 Rin=500Meg  ; pins In+ In- V+ V- OUT
C12 N006 0 1n
C13 N010 0 1n
V15 VCC 0 9
V16 0 VEE 9
V18 InputSignal 0 SINE(0 10m 500 0)
Q_RF3 N032 N041 N043 0 2N2222
Q_Tail2 N043 N047 N049 0 BC547C
R40 N011 N024 3.3k
R41 N024 N036 2.2k
R42 N046 0 1.5k
R43 N036 N046 2.2k
C19 N046 0 10µ V=10 Irms=23m Rser=2.4699 Lser=942p mfg="Würth Elektronik" pn="865090240001 WCAP-ASLU 4x5,5" type="Al electrolytic"
C20 N036 0 10µ V=10 Irms=23m Rser=2.4699 Lser=942p mfg="Würth Elektronik" pn="865090240001 WCAP-ASLU 4x5,5" type="Al electrolytic"
C21 N024 0 10µ V=10 Irms=23m Rser=2.4699 Lser=942p mfg="Würth Elektronik" pn="865090240001 WCAP-ASLU 4x5,5" type="Al electrolytic"
R44 N049 0 390
R45 N047 N046 10k
Q_RF4 N034 N037 N043 0 2N2222
Q_LO5 N012 N014 N032 0 2N2222
Q_LO6 N025 N029 N032 0 2N2222
Q_LO7 N012 N029 N034 0 2N2222
Q_LO8 N025 N014 N034 0 2N2222
R46 N011 N025 2.2k
R47 N014 N024 10K tol=1 pwr=0.1
R48 N029 N024 10K tol=1 pwr=0.1
C22 0 N029 100n V=10 Irms=0 Rser=0.025 Lser=913p
R49 N041 N036 10K tol=1 pwr=0.1
R50 N037 N036 10K tol=1 pwr=0.1
C23 0 N037 100n V=10 Irms=0 Rser=0.025 Lser=913p
R51 N011 N012 2.2k
C24 N014 InFilteredout 10n
C25 vco N041 10n
V21 N011 0 9
C14 N025 mix_out 10n
.model D D
.lib standard.dio
.model NPN NPN
.model PNP PNP
.lib standard.bjt
.tran 0 500m 0 1u
.options plotwinsize=0 numdgt=7
* Center = 5kHz
* BW = 100Hz
* Center = 7.5kHz
* BW = 100Hz
* GND
* 9V
* SRCH
* OUT
* .tran 2s
.lib LTC.lib
.lib UniversalOpAmp2.lib
.backanno
.end